# Vivado block design design_1, xczu48dr-ffvg1517-2-e, Vivado 2024.1
# (continued, part 3 of 7)
current_bd_instance /hp_sec8/One_port8/CAMC_with3
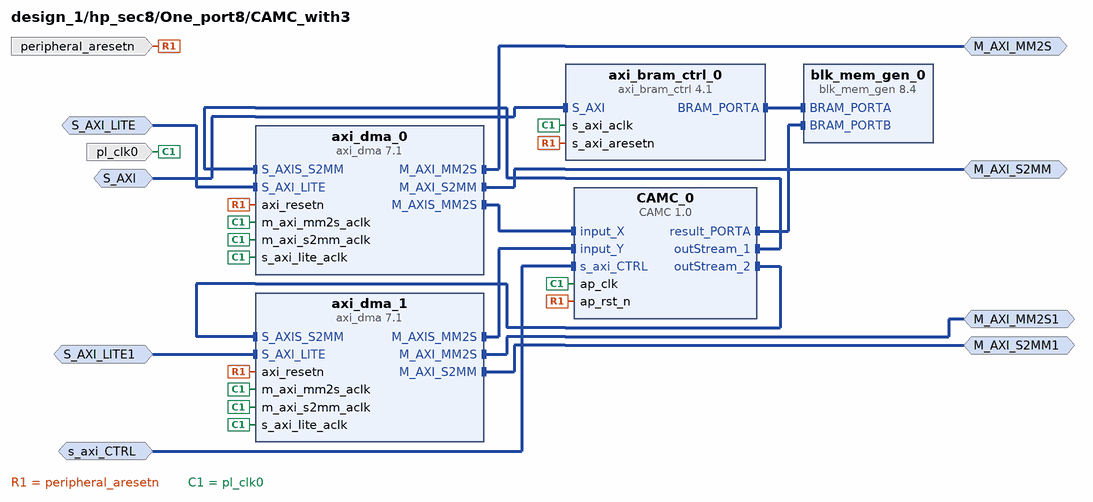
[diagram p48: block diagram inside /hp_sec8/One_port8/CAMC_with3]
create_bd_intf_pin -mode Master -vlnv xilinx.com:interface:aximm_rtl:1.0 M_AXI_MM2S
create_bd_intf_pin -mode Master -vlnv xilinx.com:interface:aximm_rtl:1.0 M_AXI_S2MM
create_bd_intf_pin -mode Slave -vlnv xilinx.com:interface:aximm_rtl:1.0 S_AXI
create_bd_intf_pin -mode Slave -vlnv xilinx.com:interface:aximm_rtl:1.0 S_AXI_LITE
create_bd_intf_pin -mode Master -vlnv xilinx.com:interface:aximm_rtl:1.0 M_AXI_MM2S1
create_bd_intf_pin -mode Master -vlnv xilinx.com:interface:aximm_rtl:1.0 M_AXI_S2MM1
create_bd_intf_pin -mode Slave -vlnv xilinx.com:interface:aximm_rtl:1.0 S_AXI_LITE1
create_bd_intf_pin -mode Slave -vlnv xilinx.com:interface:aximm_rtl:1.0 s_axi_CTRL
create_bd_pin -dir I -type clk pl_clk0
create_bd_pin -dir I -type rst peripheral_aresetn

create_bd_cell -type ip -vlnv xilinx.com:hls:CAMC:1.0 CAMC_0
create_bd_cell -type ip -vlnv xilinx.com:ip:axi_bram_ctrl:4.1 axi_bram_ctrl_0
set_property -dict {CONFIG.SINGLE_PORT_BRAM 1} [get_bd_cells axi_bram_ctrl_0]
create_bd_cell -type ip -vlnv xilinx.com:ip:axi_dma:7.1 axi_dma_0
set_property -dict {CONFIG.c_include_mm2s_dre 1 CONFIG.c_include_s2mm_dre 1 CONFIG.c_include_sg 0} [get_bd_cells axi_dma_0]
create_bd_cell -type ip -vlnv xilinx.com:ip:axi_dma:7.1 axi_dma_1
set_property -dict {CONFIG.c_include_mm2s_dre 1 CONFIG.c_include_s2mm_dre 1 CONFIG.c_include_sg 0} [get_bd_cells axi_dma_1]
create_bd_cell -type ip -vlnv xilinx.com:ip:blk_mem_gen:8.4 blk_mem_gen_0
set_property -dict {CONFIG.Memory_Type True_Dual_Port_RAM} [get_bd_cells blk_mem_gen_0]

# ---- connections ----

current_bd_instance /hp_sec
connect_bd_intf_net [get_bd_intf_pins smartconnect_0/S00_AXI] [get_bd_intf_pins S00_AXI]
connect_bd_intf_net [get_bd_intf_pins M00_AXI] [get_bd_intf_pins One_port8/M00_AXI]
connect_bd_intf_net [get_bd_intf_pins One_port8/S_AXI1] [get_bd_intf_pins smartconnect_0/M01_AXI]
connect_bd_intf_net [get_bd_intf_pins One_port8/S_AXI2] [get_bd_intf_pins smartconnect_0/M02_AXI]
connect_bd_intf_net [get_bd_intf_pins One_port8/S_AXI3] [get_bd_intf_pins smartconnect_0/M03_AXI]
connect_bd_intf_net [get_bd_intf_pins One_port8/S_AXI] [get_bd_intf_pins smartconnect_0/M00_AXI]
connect_bd_intf_net [get_bd_intf_pins One_port8/S_AXI_LITE1] [get_bd_intf_pins smartconnect_0/M05_AXI]
connect_bd_intf_net [get_bd_intf_pins One_port8/S_AXI_LITE2] [get_bd_intf_pins smartconnect_0/M06_AXI]
connect_bd_intf_net [get_bd_intf_pins One_port8/S_AXI_LITE] [get_bd_intf_pins smartconnect_0/M04_AXI]
connect_bd_intf_net [get_bd_intf_pins smartconnect_0/M07_AXI] [get_bd_intf_pins One_port8/S_AXI_LITE3]
connect_bd_intf_net [get_bd_intf_pins smartconnect_0/M08_AXI] [get_bd_intf_pins One_port8/S_AXI_LITE4]
connect_bd_intf_net [get_bd_intf_pins smartconnect_0/M09_AXI] [get_bd_intf_pins One_port8/S_AXI_LITE5]
connect_bd_intf_net [get_bd_intf_pins smartconnect_0/M10_AXI] [get_bd_intf_pins One_port8/S_AXI_LITE6]
connect_bd_intf_net [get_bd_intf_pins smartconnect_0/M11_AXI] [get_bd_intf_pins One_port8/S_AXI_LITE7]
connect_bd_intf_net [get_bd_intf_pins smartconnect_0/M12_AXI] [get_bd_intf_pins One_port8/s_axi_CTRL]
connect_bd_intf_net [get_bd_intf_pins smartconnect_0/M13_AXI] [get_bd_intf_pins One_port8/s_axi_CTRL1]
connect_bd_intf_net [get_bd_intf_pins smartconnect_0/M14_AXI] [get_bd_intf_pins One_port8/s_axi_CTRL2]
connect_bd_intf_net [get_bd_intf_pins smartconnect_0/M15_AXI] [get_bd_intf_pins One_port8/s_axi_CTRL3]
connect_bd_net [get_bd_pins s_axi_aclk] [get_bd_pins One_port8/s_axi_aclk] [get_bd_pins smartconnect_0/aclk]
connect_bd_net [get_bd_pins s_axi_aresetn] [get_bd_pins One_port8/s_axi_aresetn]

current_bd_instance /hp_sec/One_port8
connect_bd_intf_net [get_bd_intf_pins axi_interconnect_0/M00_AXI] [get_bd_intf_pins M00_AXI]
connect_bd_intf_net [get_bd_intf_pins CAMC_with/S_AXI] [get_bd_intf_pins S_AXI]
connect_bd_intf_net [get_bd_intf_pins CAMC_with1/S_AXI] [get_bd_intf_pins S_AXI1]
connect_bd_intf_net [get_bd_intf_pins CAMC_with2/S_AXI] [get_bd_intf_pins S_AXI2]
connect_bd_intf_net [get_bd_intf_pins CAMC_with3/S_AXI] [get_bd_intf_pins S_AXI3]
connect_bd_intf_net [get_bd_intf_pins CAMC_with/S_AXI_LITE] [get_bd_intf_pins S_AXI_LITE]
connect_bd_intf_net [get_bd_intf_pins CAMC_with/S_AXI_LITE1] [get_bd_intf_pins S_AXI_LITE1]
connect_bd_intf_net [get_bd_intf_pins CAMC_with1/S_AXI_LITE] [get_bd_intf_pins S_AXI_LITE2]
connect_bd_intf_net [get_bd_intf_pins CAMC_with1/S_AXI_LITE1] [get_bd_intf_pins S_AXI_LITE3]
connect_bd_intf_net [get_bd_intf_pins CAMC_with2/S_AXI_LITE] [get_bd_intf_pins S_AXI_LITE4]
connect_bd_intf_net [get_bd_intf_pins CAMC_with2/S_AXI_LITE1] [get_bd_intf_pins S_AXI_LITE5]
connect_bd_intf_net [get_bd_intf_pins CAMC_with3/S_AXI_LITE] [get_bd_intf_pins S_AXI_LITE6]
connect_bd_intf_net [get_bd_intf_pins CAMC_with3/S_AXI_LITE1] [get_bd_intf_pins S_AXI_LITE7]
connect_bd_intf_net [get_bd_intf_pins CAMC_with/s_axi_CTRL] [get_bd_intf_pins s_axi_CTRL]
connect_bd_intf_net [get_bd_intf_pins CAMC_with1/s_axi_CTRL] [get_bd_intf_pins s_axi_CTRL1]
connect_bd_intf_net [get_bd_intf_pins CAMC_with2/s_axi_CTRL] [get_bd_intf_pins s_axi_CTRL2]
connect_bd_intf_net [get_bd_intf_pins CAMC_with3/s_axi_CTRL] [get_bd_intf_pins s_axi_CTRL3]
connect_bd_intf_net [get_bd_intf_pins axi_interconnect_0/S00_AXI] [get_bd_intf_pins CAMC_with/M_AXI_MM2S]
connect_bd_intf_net [get_bd_intf_pins axi_interconnect_0/S01_AXI] [get_bd_intf_pins CAMC_with/M_AXI_S2MM]
connect_bd_intf_net [get_bd_intf_pins axi_interconnect_0/S02_AXI] [get_bd_intf_pins CAMC_with1/M_AXI_MM2S]
connect_bd_intf_net [get_bd_intf_pins axi_interconnect_0/S03_AXI] [get_bd_intf_pins CAMC_with1/M_AXI_S2MM]
connect_bd_intf_net [get_bd_intf_pins axi_interconnect_0/S04_AXI] [get_bd_intf_pins CAMC_with2/M_AXI_MM2S]
connect_bd_intf_net [get_bd_intf_pins axi_interconnect_0/S05_AXI] [get_bd_intf_pins CAMC_with2/M_AXI_S2MM]
connect_bd_intf_net [get_bd_intf_pins axi_interconnect_0/S06_AXI] [get_bd_intf_pins CAMC_with3/M_AXI_MM2S]
connect_bd_intf_net [get_bd_intf_pins axi_interconnect_0/S07_AXI] [get_bd_intf_pins CAMC_with3/M_AXI_S2MM]
connect_bd_intf_net [get_bd_intf_pins axi_interconnect_0/S08_AXI] [get_bd_intf_pins CAMC_with/M_AXI_MM2S1]
connect_bd_intf_net [get_bd_intf_pins axi_interconnect_0/S09_AXI] [get_bd_intf_pins CAMC_with/M_AXI_S2MM1]
connect_bd_intf_net [get_bd_intf_pins axi_interconnect_0/S10_AXI] [get_bd_intf_pins CAMC_with1/M_AXI_MM2S1]
connect_bd_intf_net [get_bd_intf_pins axi_interconnect_0/S11_AXI] [get_bd_intf_pins CAMC_with1/M_AXI_S2MM1]
connect_bd_intf_net [get_bd_intf_pins axi_interconnect_0/S12_AXI] [get_bd_intf_pins CAMC_with2/M_AXI_MM2S1]
connect_bd_intf_net [get_bd_intf_pins axi_interconnect_0/S13_AXI] [get_bd_intf_pins CAMC_with2/M_AXI_S2MM1]
connect_bd_intf_net [get_bd_intf_pins axi_interconnect_0/S14_AXI] [get_bd_intf_pins CAMC_with3/M_AXI_MM2S1]
connect_bd_intf_net [get_bd_intf_pins axi_interconnect_0/S15_AXI] [get_bd_intf_pins CAMC_with3/M_AXI_S2MM1]
connect_bd_net [get_bd_pins s_axi_aclk] \
  [get_bd_pins CAMC_with/s_axi_aclk] [get_bd_pins CAMC_with1/pl_clk0] [get_bd_pins CAMC_with2/pl_clk0] \
  [get_bd_pins CAMC_with3/pl_clk0] [get_bd_pins axi_interconnect_0/S00_ACLK] [get_bd_pins axi_interconnect_0/S01_ACLK] \
  [get_bd_pins axi_interconnect_0/S08_ACLK] [get_bd_pins axi_interconnect_0/M00_ACLK] [get_bd_pins axi_interconnect_0/ACLK] \
  [get_bd_pins axi_interconnect_0/S09_ACLK] [get_bd_pins axi_interconnect_0/S02_ACLK] \
  [get_bd_pins axi_interconnect_0/S03_ACLK] [get_bd_pins axi_interconnect_0/S10_ACLK] \
  [get_bd_pins axi_interconnect_0/S11_ACLK] [get_bd_pins axi_interconnect_0/S04_ACLK] \
  [get_bd_pins axi_interconnect_0/S05_ACLK] [get_bd_pins axi_interconnect_0/S12_ACLK] \
  [get_bd_pins axi_interconnect_0/S13_ACLK] [get_bd_pins axi_interconnect_0/S06_ACLK] \
  [get_bd_pins axi_interconnect_0/S07_ACLK] [get_bd_pins axi_interconnect_0/S14_ACLK] \
  [get_bd_pins axi_interconnect_0/S15_ACLK]
connect_bd_net [get_bd_pins s_axi_aresetn] \
  [get_bd_pins CAMC_with/s_axi_aresetn] [get_bd_pins CAMC_with1/peripheral_aresetn] \
  [get_bd_pins CAMC_with2/peripheral_aresetn] [get_bd_pins CAMC_with3/peripheral_aresetn] \
  [get_bd_pins axi_interconnect_0/S00_ARESETN] [get_bd_pins axi_interconnect_0/S01_ARESETN] \
  [get_bd_pins axi_interconnect_0/S08_ARESETN] [get_bd_pins axi_interconnect_0/M00_ARESETN] \
  [get_bd_pins axi_interconnect_0/ARESETN] [get_bd_pins axi_interconnect_0/S09_ARESETN] \
  [get_bd_pins axi_interconnect_0/S02_ARESETN] [get_bd_pins axi_interconnect_0/S03_ARESETN] \
  [get_bd_pins axi_interconnect_0/S10_ARESETN] [get_bd_pins axi_interconnect_0/S11_ARESETN] \
  [get_bd_pins axi_interconnect_0/S04_ARESETN] [get_bd_pins axi_interconnect_0/S05_ARESETN] \
  [get_bd_pins axi_interconnect_0/S12_ARESETN] [get_bd_pins axi_interconnect_0/S13_ARESETN] \
  [get_bd_pins axi_interconnect_0/S06_ARESETN] [get_bd_pins axi_interconnect_0/S07_ARESETN] \
  [get_bd_pins axi_interconnect_0/S14_ARESETN] [get_bd_pins axi_interconnect_0/S15_ARESETN]

current_bd_instance /hp_sec/One_port8/CAMC_with
connect_bd_intf_net [get_bd_intf_pins axi_dma_0/S_AXIS_S2MM] [get_bd_intf_pins CAMC_0/outStream_1]
connect_bd_intf_net [get_bd_intf_pins axi_dma_1/S_AXIS_S2MM] [get_bd_intf_pins CAMC_0/outStream_2]
connect_bd_intf_net [get_bd_intf_pins blk_mem_gen_0/BRAM_PORTB] [get_bd_intf_pins CAMC_0/result_PORTA]
connect_bd_intf_net [get_bd_intf_pins axi_dma_0/M_AXI_MM2S] [get_bd_intf_pins M_AXI_MM2S]
connect_bd_intf_net [get_bd_intf_pins axi_dma_0/M_AXI_S2MM] [get_bd_intf_pins M_AXI_S2MM]
connect_bd_intf_net [get_bd_intf_pins axi_bram_ctrl_0/S_AXI] [get_bd_intf_pins S_AXI]
connect_bd_intf_net [get_bd_intf_pins axi_dma_0/S_AXI_LITE] [get_bd_intf_pins S_AXI_LITE]
connect_bd_intf_net [get_bd_intf_pins axi_dma_1/M_AXI_MM2S] [get_bd_intf_pins M_AXI_MM2S1]
connect_bd_intf_net [get_bd_intf_pins axi_dma_1/M_AXI_S2MM] [get_bd_intf_pins M_AXI_S2MM1]
connect_bd_intf_net [get_bd_intf_pins axi_dma_1/S_AXI_LITE] [get_bd_intf_pins S_AXI_LITE1]
connect_bd_intf_net [get_bd_intf_pins CAMC_0/s_axi_CTRL] [get_bd_intf_pins s_axi_CTRL]
connect_bd_intf_net [get_bd_intf_pins axi_bram_ctrl_0/BRAM_PORTA] [get_bd_intf_pins blk_mem_gen_0/BRAM_PORTA]
connect_bd_intf_net [get_bd_intf_pins CAMC_0/input_X] [get_bd_intf_pins axi_dma_0/M_AXIS_MM2S]
connect_bd_intf_net [get_bd_intf_pins CAMC_0/input_Y] [get_bd_intf_pins axi_dma_1/M_AXIS_MM2S]
connect_bd_net [get_bd_pins s_axi_aclk] \
  [get_bd_pins axi_bram_ctrl_0/s_axi_aclk] [get_bd_pins axi_dma_0/m_axi_mm2s_aclk] [get_bd_pins CAMC_0/ap_clk] \
  [get_bd_pins axi_dma_0/m_axi_s2mm_aclk] [get_bd_pins axi_dma_0/s_axi_lite_aclk] [get_bd_pins axi_dma_1/m_axi_mm2s_aclk] \
  [get_bd_pins axi_dma_1/m_axi_s2mm_aclk] [get_bd_pins axi_dma_1/s_axi_lite_aclk]
connect_bd_net [get_bd_pins s_axi_aresetn] \
  [get_bd_pins axi_bram_ctrl_0/s_axi_aresetn] [get_bd_pins CAMC_0/ap_rst_n] [get_bd_pins axi_dma_0/axi_resetn] \
  [get_bd_pins axi_dma_1/axi_resetn]

current_bd_instance /hp_sec/One_port8/CAMC_with1
connect_bd_intf_net [get_bd_intf_pins axi_dma_0/S_AXIS_S2MM] [get_bd_intf_pins CAMC_0/outStream_1]
connect_bd_intf_net [get_bd_intf_pins axi_dma_1/S_AXIS_S2MM] [get_bd_intf_pins CAMC_0/outStream_2]
connect_bd_intf_net [get_bd_intf_pins blk_mem_gen_0/BRAM_PORTB] [get_bd_intf_pins CAMC_0/result_PORTA]
connect_bd_intf_net [get_bd_intf_pins axi_dma_0/M_AXI_MM2S] [get_bd_intf_pins M_AXI_MM2S]
connect_bd_intf_net [get_bd_intf_pins axi_dma_0/M_AXI_S2MM] [get_bd_intf_pins M_AXI_S2MM]
connect_bd_intf_net [get_bd_intf_pins axi_bram_ctrl_0/S_AXI] [get_bd_intf_pins S_AXI]
connect_bd_intf_net [get_bd_intf_pins axi_dma_0/S_AXI_LITE] [get_bd_intf_pins S_AXI_LITE]
connect_bd_intf_net [get_bd_intf_pins axi_dma_1/M_AXI_MM2S] [get_bd_intf_pins M_AXI_MM2S1]
connect_bd_intf_net [get_bd_intf_pins axi_dma_1/M_AXI_S2MM] [get_bd_intf_pins M_AXI_S2MM1]
connect_bd_intf_net [get_bd_intf_pins axi_dma_1/S_AXI_LITE] [get_bd_intf_pins S_AXI_LITE1]
connect_bd_intf_net [get_bd_intf_pins CAMC_0/s_axi_CTRL] [get_bd_intf_pins s_axi_CTRL]
connect_bd_intf_net [get_bd_intf_pins axi_bram_ctrl_0/BRAM_PORTA] [get_bd_intf_pins blk_mem_gen_0/BRAM_PORTA]
connect_bd_intf_net [get_bd_intf_pins CAMC_0/input_X] [get_bd_intf_pins axi_dma_0/M_AXIS_MM2S]
connect_bd_intf_net [get_bd_intf_pins CAMC_0/input_Y] [get_bd_intf_pins axi_dma_1/M_AXIS_MM2S]
connect_bd_net [get_bd_pins peripheral_aresetn] \
  [get_bd_pins axi_bram_ctrl_0/s_axi_aresetn] [get_bd_pins CAMC_0/ap_rst_n] [get_bd_pins axi_dma_0/axi_resetn] \
  [get_bd_pins axi_dma_1/axi_resetn]
connect_bd_net -net pl_clk0_1 [get_bd_pins pl_clk0] \
  [get_bd_pins axi_bram_ctrl_0/s_axi_aclk] [get_bd_pins axi_dma_0/m_axi_mm2s_aclk] [get_bd_pins CAMC_0/ap_clk] \
  [get_bd_pins axi_dma_0/m_axi_s2mm_aclk] [get_bd_pins axi_dma_0/s_axi_lite_aclk] [get_bd_pins axi_dma_1/m_axi_mm2s_aclk] \
  [get_bd_pins axi_dma_1/m_axi_s2mm_aclk] [get_bd_pins axi_dma_1/s_axi_lite_aclk]

current_bd_instance /hp_sec/One_port8/CAMC_with2
connect_bd_intf_net [get_bd_intf_pins axi_dma_0/S_AXIS_S2MM] [get_bd_intf_pins CAMC_0/outStream_1]
connect_bd_intf_net [get_bd_intf_pins axi_dma_1/S_AXIS_S2MM] [get_bd_intf_pins CAMC_0/outStream_2]
connect_bd_intf_net [get_bd_intf_pins blk_mem_gen_0/BRAM_PORTB] [get_bd_intf_pins CAMC_0/result_PORTA]
connect_bd_intf_net [get_bd_intf_pins axi_dma_0/M_AXI_MM2S] [get_bd_intf_pins M_AXI_MM2S]
connect_bd_intf_net [get_bd_intf_pins axi_dma_0/M_AXI_S2MM] [get_bd_intf_pins M_AXI_S2MM]
connect_bd_intf_net [get_bd_intf_pins axi_bram_ctrl_0/S_AXI] [get_bd_intf_pins S_AXI]
connect_bd_intf_net [get_bd_intf_pins axi_dma_0/S_AXI_LITE] [get_bd_intf_pins S_AXI_LITE]
connect_bd_intf_net [get_bd_intf_pins axi_dma_1/M_AXI_MM2S] [get_bd_intf_pins M_AXI_MM2S1]
connect_bd_intf_net [get_bd_intf_pins axi_dma_1/M_AXI_S2MM] [get_bd_intf_pins M_AXI_S2MM1]
connect_bd_intf_net [get_bd_intf_pins axi_dma_1/S_AXI_LITE] [get_bd_intf_pins S_AXI_LITE1]
connect_bd_intf_net [get_bd_intf_pins CAMC_0/s_axi_CTRL] [get_bd_intf_pins s_axi_CTRL]
connect_bd_intf_net [get_bd_intf_pins axi_bram_ctrl_0/BRAM_PORTA] [get_bd_intf_pins blk_mem_gen_0/BRAM_PORTA]
connect_bd_intf_net [get_bd_intf_pins CAMC_0/input_X] [get_bd_intf_pins axi_dma_0/M_AXIS_MM2S]
connect_bd_intf_net [get_bd_intf_pins CAMC_0/input_Y] [get_bd_intf_pins axi_dma_1/M_AXIS_MM2S]
connect_bd_net [get_bd_pins peripheral_aresetn] \
  [get_bd_pins axi_bram_ctrl_0/s_axi_aresetn] [get_bd_pins CAMC_0/ap_rst_n] [get_bd_pins axi_dma_0/axi_resetn] \
  [get_bd_pins axi_dma_1/axi_resetn]
connect_bd_net -net pl_clk0_1 [get_bd_pins pl_clk0] \
  [get_bd_pins axi_bram_ctrl_0/s_axi_aclk] [get_bd_pins axi_dma_0/m_axi_mm2s_aclk] [get_bd_pins CAMC_0/ap_clk] \
  [get_bd_pins axi_dma_0/m_axi_s2mm_aclk] [get_bd_pins axi_dma_0/s_axi_lite_aclk] [get_bd_pins axi_dma_1/m_axi_mm2s_aclk] \
  [get_bd_pins axi_dma_1/m_axi_s2mm_aclk] [get_bd_pins axi_dma_1/s_axi_lite_aclk]

current_bd_instance /hp_sec/One_port8/CAMC_with3
connect_bd_intf_net [get_bd_intf_pins axi_dma_0/S_AXIS_S2MM] [get_bd_intf_pins CAMC_0/outStream_1]
connect_bd_intf_net [get_bd_intf_pins axi_dma_1/S_AXIS_S2MM] [get_bd_intf_pins CAMC_0/outStream_2]
connect_bd_intf_net [get_bd_intf_pins blk_mem_gen_0/BRAM_PORTB] [get_bd_intf_pins CAMC_0/result_PORTA]
connect_bd_intf_net [get_bd_intf_pins axi_dma_0/M_AXI_MM2S] [get_bd_intf_pins M_AXI_MM2S]
connect_bd_intf_net [get_bd_intf_pins axi_dma_0/M_AXI_S2MM] [get_bd_intf_pins M_AXI_S2MM]
connect_bd_intf_net [get_bd_intf_pins axi_bram_ctrl_0/S_AXI] [get_bd_intf_pins S_AXI]
connect_bd_intf_net [get_bd_intf_pins axi_dma_0/S_AXI_LITE] [get_bd_intf_pins S_AXI_LITE]
connect_bd_intf_net [get_bd_intf_pins axi_dma_1/M_AXI_MM2S] [get_bd_intf_pins M_AXI_MM2S1]
connect_bd_intf_net [get_bd_intf_pins axi_dma_1/M_AXI_S2MM] [get_bd_intf_pins M_AXI_S2MM1]
connect_bd_intf_net [get_bd_intf_pins axi_dma_1/S_AXI_LITE] [get_bd_intf_pins S_AXI_LITE1]
connect_bd_intf_net [get_bd_intf_pins CAMC_0/s_axi_CTRL] [get_bd_intf_pins s_axi_CTRL]
connect_bd_intf_net [get_bd_intf_pins axi_bram_ctrl_0/BRAM_PORTA] [get_bd_intf_pins blk_mem_gen_0/BRAM_PORTA]
connect_bd_intf_net [get_bd_intf_pins CAMC_0/input_X] [get_bd_intf_pins axi_dma_0/M_AXIS_MM2S]
connect_bd_intf_net [get_bd_intf_pins CAMC_0/input_Y] [get_bd_intf_pins axi_dma_1/M_AXIS_MM2S]
connect_bd_net [get_bd_pins peripheral_aresetn] \
  [get_bd_pins axi_bram_ctrl_0/s_axi_aresetn] [get_bd_pins CAMC_0/ap_rst_n] [get_bd_pins axi_dma_0/axi_resetn] \
  [get_bd_pins axi_dma_1/axi_resetn]
connect_bd_net -net pl_clk0_1 [get_bd_pins pl_clk0] \
  [get_bd_pins axi_bram_ctrl_0/s_axi_aclk] [get_bd_pins axi_dma_0/m_axi_mm2s_aclk] [get_bd_pins CAMC_0/ap_clk] \
  [get_bd_pins axi_dma_0/m_axi_s2mm_aclk] [get_bd_pins axi_dma_0/s_axi_lite_aclk] [get_bd_pins axi_dma_1/m_axi_mm2s_aclk] \
  [get_bd_pins axi_dma_1/m_axi_s2mm_aclk] [get_bd_pins axi_dma_1/s_axi_lite_aclk]

current_bd_instance /hp_sec1
connect_bd_intf_net [get_bd_intf_pins smartconnect_0/S00_AXI] [get_bd_intf_pins S00_AXI]
connect_bd_intf_net [get_bd_intf_pins M00_AXI] [get_bd_intf_pins One_port8/M00_AXI]
connect_bd_intf_net [get_bd_intf_pins One_port8/S_AXI1] [get_bd_intf_pins smartconnect_0/M01_AXI]
connect_bd_intf_net [get_bd_intf_pins One_port8/S_AXI2] [get_bd_intf_pins smartconnect_0/M02_AXI]
connect_bd_intf_net [get_bd_intf_pins One_port8/S_AXI3] [get_bd_intf_pins smartconnect_0/M03_AXI]
connect_bd_intf_net [get_bd_intf_pins One_port8/S_AXI] [get_bd_intf_pins smartconnect_0/M00_AXI]
connect_bd_intf_net [get_bd_intf_pins One_port8/S_AXI_LITE1] [get_bd_intf_pins smartconnect_0/M05_AXI]
connect_bd_intf_net [get_bd_intf_pins One_port8/S_AXI_LITE2] [get_bd_intf_pins smartconnect_0/M06_AXI]
connect_bd_intf_net [get_bd_intf_pins One_port8/S_AXI_LITE] [get_bd_intf_pins smartconnect_0/M04_AXI]
connect_bd_intf_net [get_bd_intf_pins smartconnect_0/M07_AXI] [get_bd_intf_pins One_port8/S_AXI_LITE3]
connect_bd_intf_net [get_bd_intf_pins smartconnect_0/M08_AXI] [get_bd_intf_pins One_port8/S_AXI_LITE4]
connect_bd_intf_net [get_bd_intf_pins smartconnect_0/M09_AXI] [get_bd_intf_pins One_port8/S_AXI_LITE5]
connect_bd_intf_net [get_bd_intf_pins smartconnect_0/M10_AXI] [get_bd_intf_pins One_port8/S_AXI_LITE6]
connect_bd_intf_net [get_bd_intf_pins smartconnect_0/M11_AXI] [get_bd_intf_pins One_port8/S_AXI_LITE7]
connect_bd_intf_net [get_bd_intf_pins smartconnect_0/M12_AXI] [get_bd_intf_pins One_port8/s_axi_CTRL]
connect_bd_intf_net [get_bd_intf_pins smartconnect_0/M13_AXI] [get_bd_intf_pins One_port8/s_axi_CTRL1]
connect_bd_intf_net [get_bd_intf_pins smartconnect_0/M14_AXI] [get_bd_intf_pins One_port8/s_axi_CTRL2]
connect_bd_intf_net [get_bd_intf_pins smartconnect_0/M15_AXI] [get_bd_intf_pins One_port8/s_axi_CTRL3]
connect_bd_net [get_bd_pins s_axi_aclk] [get_bd_pins One_port8/s_axi_aclk] [get_bd_pins smartconnect_0/aclk]
connect_bd_net [get_bd_pins s_axi_aresetn] [get_bd_pins One_port8/s_axi_aresetn]

current_bd_instance /hp_sec1/One_port8
connect_bd_intf_net [get_bd_intf_pins axi_interconnect_0/M00_AXI] [get_bd_intf_pins M00_AXI]
connect_bd_intf_net [get_bd_intf_pins CAMC_with/S_AXI] [get_bd_intf_pins S_AXI]
connect_bd_intf_net [get_bd_intf_pins CAMC_with1/S_AXI] [get_bd_intf_pins S_AXI1]
connect_bd_intf_net [get_bd_intf_pins CAMC_with2/S_AXI] [get_bd_intf_pins S_AXI2]
connect_bd_intf_net [get_bd_intf_pins CAMC_with3/S_AXI] [get_bd_intf_pins S_AXI3]
connect_bd_intf_net [get_bd_intf_pins CAMC_with/S_AXI_LITE] [get_bd_intf_pins S_AXI_LITE]
connect_bd_intf_net [get_bd_intf_pins CAMC_with/S_AXI_LITE1] [get_bd_intf_pins S_AXI_LITE1]
connect_bd_intf_net [get_bd_intf_pins CAMC_with1/S_AXI_LITE] [get_bd_intf_pins S_AXI_LITE2]
connect_bd_intf_net [get_bd_intf_pins CAMC_with1/S_AXI_LITE1] [get_bd_intf_pins S_AXI_LITE3]
connect_bd_intf_net [get_bd_intf_pins CAMC_with2/S_AXI_LITE] [get_bd_intf_pins S_AXI_LITE4]
connect_bd_intf_net [get_bd_intf_pins CAMC_with2/S_AXI_LITE1] [get_bd_intf_pins S_AXI_LITE5]
connect_bd_intf_net [get_bd_intf_pins CAMC_with3/S_AXI_LITE] [get_bd_intf_pins S_AXI_LITE6]
connect_bd_intf_net [get_bd_intf_pins CAMC_with3/S_AXI_LITE1] [get_bd_intf_pins S_AXI_LITE7]
connect_bd_intf_net [get_bd_intf_pins CAMC_with/s_axi_CTRL] [get_bd_intf_pins s_axi_CTRL]
connect_bd_intf_net [get_bd_intf_pins CAMC_with1/s_axi_CTRL] [get_bd_intf_pins s_axi_CTRL1]
connect_bd_intf_net [get_bd_intf_pins CAMC_with2/s_axi_CTRL] [get_bd_intf_pins s_axi_CTRL2]
connect_bd_intf_net [get_bd_intf_pins CAMC_with3/s_axi_CTRL] [get_bd_intf_pins s_axi_CTRL3]
connect_bd_intf_net [get_bd_intf_pins axi_interconnect_0/S00_AXI] [get_bd_intf_pins CAMC_with/M_AXI_MM2S]
connect_bd_intf_net [get_bd_intf_pins axi_interconnect_0/S01_AXI] [get_bd_intf_pins CAMC_with/M_AXI_S2MM]
connect_bd_intf_net [get_bd_intf_pins axi_interconnect_0/S02_AXI] [get_bd_intf_pins CAMC_with1/M_AXI_MM2S]
connect_bd_intf_net [get_bd_intf_pins axi_interconnect_0/S03_AXI] [get_bd_intf_pins CAMC_with1/M_AXI_S2MM]
connect_bd_intf_net [get_bd_intf_pins axi_interconnect_0/S04_AXI] [get_bd_intf_pins CAMC_with2/M_AXI_MM2S]
connect_bd_intf_net [get_bd_intf_pins axi_interconnect_0/S05_AXI] [get_bd_intf_pins CAMC_with2/M_AXI_S2MM]
connect_bd_intf_net [get_bd_intf_pins axi_interconnect_0/S06_AXI] [get_bd_intf_pins CAMC_with3/M_AXI_MM2S]
connect_bd_intf_net [get_bd_intf_pins axi_interconnect_0/S07_AXI] [get_bd_intf_pins CAMC_with3/M_AXI_S2MM]
connect_bd_intf_net [get_bd_intf_pins axi_interconnect_0/S08_AXI] [get_bd_intf_pins CAMC_with/M_AXI_MM2S1]
connect_bd_intf_net [get_bd_intf_pins axi_interconnect_0/S09_AXI] [get_bd_intf_pins CAMC_with/M_AXI_S2MM1]
connect_bd_intf_net [get_bd_intf_pins axi_interconnect_0/S10_AXI] [get_bd_intf_pins CAMC_with1/M_AXI_MM2S1]
connect_bd_intf_net [get_bd_intf_pins axi_interconnect_0/S11_AXI] [get_bd_intf_pins CAMC_with1/M_AXI_S2MM1]
connect_bd_intf_net [get_bd_intf_pins axi_interconnect_0/S12_AXI] [get_bd_intf_pins CAMC_with2/M_AXI_MM2S1]
connect_bd_intf_net [get_bd_intf_pins axi_interconnect_0/S13_AXI] [get_bd_intf_pins CAMC_with2/M_AXI_S2MM1]
connect_bd_intf_net [get_bd_intf_pins axi_interconnect_0/S14_AXI] [get_bd_intf_pins CAMC_with3/M_AXI_MM2S1]
connect_bd_intf_net [get_bd_intf_pins axi_interconnect_0/S15_AXI] [get_bd_intf_pins CAMC_with3/M_AXI_S2MM1]
connect_bd_net [get_bd_pins s_axi_aclk] \
  [get_bd_pins CAMC_with/s_axi_aclk] [get_bd_pins CAMC_with1/pl_clk0] [get_bd_pins CAMC_with2/pl_clk0] \
  [get_bd_pins CAMC_with3/pl_clk0] [get_bd_pins axi_interconnect_0/S00_ACLK] [get_bd_pins axi_interconnect_0/S01_ACLK] \
  [get_bd_pins axi_interconnect_0/S08_ACLK] [get_bd_pins axi_interconnect_0/M00_ACLK] [get_bd_pins axi_interconnect_0/ACLK] \
  [get_bd_pins axi_interconnect_0/S09_ACLK] [get_bd_pins axi_interconnect_0/S02_ACLK] \
  [get_bd_pins axi_interconnect_0/S03_ACLK] [get_bd_pins axi_interconnect_0/S10_ACLK] \
  [get_bd_pins axi_interconnect_0/S11_ACLK] [get_bd_pins axi_interconnect_0/S04_ACLK] \
  [get_bd_pins axi_interconnect_0/S05_ACLK] [get_bd_pins axi_interconnect_0/S12_ACLK] \
  [get_bd_pins axi_interconnect_0/S13_ACLK] [get_bd_pins axi_interconnect_0/S06_ACLK] \
  [get_bd_pins axi_interconnect_0/S07_ACLK] [get_bd_pins axi_interconnect_0/S14_ACLK] \
  [get_bd_pins axi_interconnect_0/S15_ACLK]
connect_bd_net [get_bd_pins s_axi_aresetn] \
  [get_bd_pins CAMC_with/s_axi_aresetn] [get_bd_pins CAMC_with1/peripheral_aresetn] \
  [get_bd_pins CAMC_with2/peripheral_aresetn] [get_bd_pins CAMC_with3/peripheral_aresetn] \
  [get_bd_pins axi_interconnect_0/S00_ARESETN] [get_bd_pins axi_interconnect_0/S01_ARESETN] \
  [get_bd_pins axi_interconnect_0/S08_ARESETN] [get_bd_pins axi_interconnect_0/M00_ARESETN] \
  [get_bd_pins axi_interconnect_0/ARESETN] [get_bd_pins axi_interconnect_0/S09_ARESETN] \
  [get_bd_pins axi_interconnect_0/S02_ARESETN] [get_bd_pins axi_interconnect_0/S03_ARESETN] \
  [get_bd_pins axi_interconnect_0/S10_ARESETN] [get_bd_pins axi_interconnect_0/S11_ARESETN] \
  [get_bd_pins axi_interconnect_0/S04_ARESETN] [get_bd_pins axi_interconnect_0/S05_ARESETN] \
  [get_bd_pins axi_interconnect_0/S12_ARESETN] [get_bd_pins axi_interconnect_0/S13_ARESETN] \
  [get_bd_pins axi_interconnect_0/S06_ARESETN] [get_bd_pins axi_interconnect_0/S07_ARESETN] \
  [get_bd_pins axi_interconnect_0/S14_ARESETN] [get_bd_pins axi_interconnect_0/S15_ARESETN]

current_bd_instance /hp_sec1/One_port8/CAMC_with
connect_bd_intf_net [get_bd_intf_pins axi_dma_0/S_AXIS_S2MM] [get_bd_intf_pins CAMC_0/outStream_1]
connect_bd_intf_net [get_bd_intf_pins axi_dma_1/S_AXIS_S2MM] [get_bd_intf_pins CAMC_0/outStream_2]
connect_bd_intf_net [get_bd_intf_pins blk_mem_gen_0/BRAM_PORTB] [get_bd_intf_pins CAMC_0/result_PORTA]
connect_bd_intf_net [get_bd_intf_pins axi_dma_0/M_AXI_MM2S] [get_bd_intf_pins M_AXI_MM2S]
connect_bd_intf_net [get_bd_intf_pins axi_dma_0/M_AXI_S2MM] [get_bd_intf_pins M_AXI_S2MM]
connect_bd_intf_net [get_bd_intf_pins axi_bram_ctrl_0/S_AXI] [get_bd_intf_pins S_AXI]
connect_bd_intf_net [get_bd_intf_pins axi_dma_0/S_AXI_LITE] [get_bd_intf_pins S_AXI_LITE]
connect_bd_intf_net [get_bd_intf_pins axi_dma_1/M_AXI_MM2S] [get_bd_intf_pins M_AXI_MM2S1]
connect_bd_intf_net [get_bd_intf_pins axi_dma_1/M_AXI_S2MM] [get_bd_intf_pins M_AXI_S2MM1]
connect_bd_intf_net [get_bd_intf_pins axi_dma_1/S_AXI_LITE] [get_bd_intf_pins S_AXI_LITE1]
connect_bd_intf_net [get_bd_intf_pins CAMC_0/s_axi_CTRL] [get_bd_intf_pins s_axi_CTRL]
connect_bd_intf_net [get_bd_intf_pins axi_bram_ctrl_0/BRAM_PORTA] [get_bd_intf_pins blk_mem_gen_0/BRAM_PORTA]
connect_bd_intf_net [get_bd_intf_pins CAMC_0/input_X] [get_bd_intf_pins axi_dma_0/M_AXIS_MM2S]
connect_bd_intf_net [get_bd_intf_pins CAMC_0/input_Y] [get_bd_intf_pins axi_dma_1/M_AXIS_MM2S]
connect_bd_net [get_bd_pins s_axi_aclk] \
  [get_bd_pins axi_bram_ctrl_0/s_axi_aclk] [get_bd_pins axi_dma_0/m_axi_mm2s_aclk] [get_bd_pins CAMC_0/ap_clk] \
  [get_bd_pins axi_dma_0/m_axi_s2mm_aclk] [get_bd_pins axi_dma_0/s_axi_lite_aclk] [get_bd_pins axi_dma_1/m_axi_mm2s_aclk] \
  [get_bd_pins axi_dma_1/m_axi_s2mm_aclk] [get_bd_pins axi_dma_1/s_axi_lite_aclk]
connect_bd_net [get_bd_pins s_axi_aresetn] \
  [get_bd_pins axi_bram_ctrl_0/s_axi_aresetn] [get_bd_pins CAMC_0/ap_rst_n] [get_bd_pins axi_dma_0/axi_resetn] \
  [get_bd_pins axi_dma_1/axi_resetn]

current_bd_instance /hp_sec1/One_port8/CAMC_with1
connect_bd_intf_net [get_bd_intf_pins axi_dma_0/S_AXIS_S2MM] [get_bd_intf_pins CAMC_0/outStream_1]
connect_bd_intf_net [get_bd_intf_pins axi_dma_1/S_AXIS_S2MM] [get_bd_intf_pins CAMC_0/outStream_2]
connect_bd_intf_net [get_bd_intf_pins blk_mem_gen_0/BRAM_PORTB] [get_bd_intf_pins CAMC_0/result_PORTA]
connect_bd_intf_net [get_bd_intf_pins axi_dma_0/M_AXI_MM2S] [get_bd_intf_pins M_AXI_MM2S]
connect_bd_intf_net [get_bd_intf_pins axi_dma_0/M_AXI_S2MM] [get_bd_intf_pins M_AXI_S2MM]
connect_bd_intf_net [get_bd_intf_pins axi_bram_ctrl_0/S_AXI] [get_bd_intf_pins S_AXI]
connect_bd_intf_net [get_bd_intf_pins axi_dma_0/S_AXI_LITE] [get_bd_intf_pins S_AXI_LITE]
connect_bd_intf_net [get_bd_intf_pins axi_dma_1/M_AXI_MM2S] [get_bd_intf_pins M_AXI_MM2S1]
connect_bd_intf_net [get_bd_intf_pins axi_dma_1/M_AXI_S2MM] [get_bd_intf_pins M_AXI_S2MM1]
connect_bd_intf_net [get_bd_intf_pins axi_dma_1/S_AXI_LITE] [get_bd_intf_pins S_AXI_LITE1]
connect_bd_intf_net [get_bd_intf_pins CAMC_0/s_axi_CTRL] [get_bd_intf_pins s_axi_CTRL]
connect_bd_intf_net [get_bd_intf_pins axi_bram_ctrl_0/BRAM_PORTA] [get_bd_intf_pins blk_mem_gen_0/BRAM_PORTA]
connect_bd_intf_net [get_bd_intf_pins CAMC_0/input_X] [get_bd_intf_pins axi_dma_0/M_AXIS_MM2S]
connect_bd_intf_net [get_bd_intf_pins CAMC_0/input_Y] [get_bd_intf_pins axi_dma_1/M_AXIS_MM2S]
connect_bd_net [get_bd_pins peripheral_aresetn] \
  [get_bd_pins axi_bram_ctrl_0/s_axi_aresetn] [get_bd_pins CAMC_0/ap_rst_n] [get_bd_pins axi_dma_0/axi_resetn] \
  [get_bd_pins axi_dma_1/axi_resetn]
connect_bd_net -net pl_clk0_1 [get_bd_pins pl_clk0] \
  [get_bd_pins axi_bram_ctrl_0/s_axi_aclk] [get_bd_pins axi_dma_0/m_axi_mm2s_aclk] [get_bd_pins CAMC_0/ap_clk] \
  [get_bd_pins axi_dma_0/m_axi_s2mm_aclk] [get_bd_pins axi_dma_0/s_axi_lite_aclk] [get_bd_pins axi_dma_1/m_axi_mm2s_aclk] \
  [get_bd_pins axi_dma_1/m_axi_s2mm_aclk] [get_bd_pins axi_dma_1/s_axi_lite_aclk]

current_bd_instance /hp_sec1/One_port8/CAMC_with2
connect_bd_intf_net [get_bd_intf_pins axi_dma_0/S_AXIS_S2MM] [get_bd_intf_pins CAMC_0/outStream_1]
connect_bd_intf_net [get_bd_intf_pins axi_dma_1/S_AXIS_S2MM] [get_bd_intf_pins CAMC_0/outStream_2]
connect_bd_intf_net [get_bd_intf_pins blk_mem_gen_0/BRAM_PORTB] [get_bd_intf_pins CAMC_0/result_PORTA]
connect_bd_intf_net [get_bd_intf_pins axi_dma_0/M_AXI_MM2S] [get_bd_intf_pins M_AXI_MM2S]
connect_bd_intf_net [get_bd_intf_pins axi_dma_0/M_AXI_S2MM] [get_bd_intf_pins M_AXI_S2MM]
connect_bd_intf_net [get_bd_intf_pins axi_bram_ctrl_0/S_AXI] [get_bd_intf_pins S_AXI]
connect_bd_intf_net [get_bd_intf_pins axi_dma_0/S_AXI_LITE] [get_bd_intf_pins S_AXI_LITE]
connect_bd_intf_net [get_bd_intf_pins axi_dma_1/M_AXI_MM2S] [get_bd_intf_pins M_AXI_MM2S1]
connect_bd_intf_net [get_bd_intf_pins axi_dma_1/M_AXI_S2MM] [get_bd_intf_pins M_AXI_S2MM1]
connect_bd_intf_net [get_bd_intf_pins axi_dma_1/S_AXI_LITE] [get_bd_intf_pins S_AXI_LITE1]
connect_bd_intf_net [get_bd_intf_pins CAMC_0/s_axi_CTRL] [get_bd_intf_pins s_axi_CTRL]
connect_bd_intf_net [get_bd_intf_pins axi_bram_ctrl_0/BRAM_PORTA] [get_bd_intf_pins blk_mem_gen_0/BRAM_PORTA]
connect_bd_intf_net [get_bd_intf_pins CAMC_0/input_X] [get_bd_intf_pins axi_dma_0/M_AXIS_MM2S]
connect_bd_intf_net [get_bd_intf_pins CAMC_0/input_Y] [get_bd_intf_pins axi_dma_1/M_AXIS_MM2S]
connect_bd_net [get_bd_pins peripheral_aresetn] \
  [get_bd_pins axi_bram_ctrl_0/s_axi_aresetn] [get_bd_pins CAMC_0/ap_rst_n] [get_bd_pins axi_dma_0/axi_resetn] \
  [get_bd_pins axi_dma_1/axi_resetn]
connect_bd_net -net pl_clk0_1 [get_bd_pins pl_clk0] \
  [get_bd_pins axi_bram_ctrl_0/s_axi_aclk] [get_bd_pins axi_dma_0/m_axi_mm2s_aclk] [get_bd_pins CAMC_0/ap_clk] \
  [get_bd_pins axi_dma_0/m_axi_s2mm_aclk] [get_bd_pins axi_dma_0/s_axi_lite_aclk] [get_bd_pins axi_dma_1/m_axi_mm2s_aclk] \
  [get_bd_pins axi_dma_1/m_axi_s2mm_aclk] [get_bd_pins axi_dma_1/s_axi_lite_aclk]

current_bd_instance /hp_sec1/One_port8/CAMC_with3
connect_bd_intf_net [get_bd_intf_pins axi_dma_0/S_AXIS_S2MM] [get_bd_intf_pins CAMC_0/outStream_1]
connect_bd_intf_net [get_bd_intf_pins axi_dma_1/S_AXIS_S2MM] [get_bd_intf_pins CAMC_0/outStream_2]
connect_bd_intf_net [get_bd_intf_pins blk_mem_gen_0/BRAM_PORTB] [get_bd_intf_pins CAMC_0/result_PORTA]
connect_bd_intf_net [get_bd_intf_pins axi_dma_0/M_AXI_MM2S] [get_bd_intf_pins M_AXI_MM2S]
connect_bd_intf_net [get_bd_intf_pins axi_dma_0/M_AXI_S2MM] [get_bd_intf_pins M_AXI_S2MM]
connect_bd_intf_net [get_bd_intf_pins axi_bram_ctrl_0/S_AXI] [get_bd_intf_pins S_AXI]
connect_bd_intf_net [get_bd_intf_pins axi_dma_0/S_AXI_LITE] [get_bd_intf_pins S_AXI_LITE]
connect_bd_intf_net [get_bd_intf_pins axi_dma_1/M_AXI_MM2S] [get_bd_intf_pins M_AXI_MM2S1]
connect_bd_intf_net [get_bd_intf_pins axi_dma_1/M_AXI_S2MM] [get_bd_intf_pins M_AXI_S2MM1]
connect_bd_intf_net [get_bd_intf_pins axi_dma_1/S_AXI_LITE] [get_bd_intf_pins S_AXI_LITE1]
connect_bd_intf_net [get_bd_intf_pins CAMC_0/s_axi_CTRL] [get_bd_intf_pins s_axi_CTRL]
connect_bd_intf_net [get_bd_intf_pins axi_bram_ctrl_0/BRAM_PORTA] [get_bd_intf_pins blk_mem_gen_0/BRAM_PORTA]
connect_bd_intf_net [get_bd_intf_pins CAMC_0/input_X] [get_bd_intf_pins axi_dma_0/M_AXIS_MM2S]
connect_bd_intf_net [get_bd_intf_pins CAMC_0/input_Y] [get_bd_intf_pins axi_dma_1/M_AXIS_MM2S]
connect_bd_net [get_bd_pins peripheral_aresetn] \
  [get_bd_pins axi_bram_ctrl_0/s_axi_aresetn] [get_bd_pins CAMC_0/ap_rst_n] [get_bd_pins axi_dma_0/axi_resetn] \
  [get_bd_pins axi_dma_1/axi_resetn]
connect_bd_net -net pl_clk0_1 [get_bd_pins pl_clk0] \
  [get_bd_pins axi_bram_ctrl_0/s_axi_aclk] [get_bd_pins axi_dma_0/m_axi_mm2s_aclk] [get_bd_pins CAMC_0/ap_clk] \
  [get_bd_pins axi_dma_0/m_axi_s2mm_aclk] [get_bd_pins axi_dma_0/s_axi_lite_aclk] [get_bd_pins axi_dma_1/m_axi_mm2s_aclk] \
  [get_bd_pins axi_dma_1/m_axi_s2mm_aclk] [get_bd_pins axi_dma_1/s_axi_lite_aclk]

current_bd_instance /hp_sec2
connect_bd_intf_net [get_bd_intf_pins smartconnect_0/S00_AXI] [get_bd_intf_pins S00_AXI]
connect_bd_intf_net [get_bd_intf_pins M00_AXI] [get_bd_intf_pins One_port8/M00_AXI]
connect_bd_intf_net [get_bd_intf_pins One_port8/S_AXI1] [get_bd_intf_pins smartconnect_0/M01_AXI]
connect_bd_intf_net [get_bd_intf_pins One_port8/S_AXI2] [get_bd_intf_pins smartconnect_0/M02_AXI]
connect_bd_intf_net [get_bd_intf_pins One_port8/S_AXI3] [get_bd_intf_pins smartconnect_0/M03_AXI]
connect_bd_intf_net [get_bd_intf_pins One_port8/S_AXI] [get_bd_intf_pins smartconnect_0/M00_AXI]
connect_bd_intf_net [get_bd_intf_pins One_port8/S_AXI_LITE1] [get_bd_intf_pins smartconnect_0/M05_AXI]
connect_bd_intf_net [get_bd_intf_pins One_port8/S_AXI_LITE2] [get_bd_intf_pins smartconnect_0/M06_AXI]
connect_bd_intf_net [get_bd_intf_pins One_port8/S_AXI_LITE] [get_bd_intf_pins smartconnect_0/M04_AXI]
connect_bd_intf_net [get_bd_intf_pins smartconnect_0/M07_AXI] [get_bd_intf_pins One_port8/S_AXI_LITE3]
connect_bd_intf_net [get_bd_intf_pins smartconnect_0/M08_AXI] [get_bd_intf_pins One_port8/S_AXI_LITE4]
connect_bd_intf_net [get_bd_intf_pins smartconnect_0/M09_AXI] [get_bd_intf_pins One_port8/S_AXI_LITE5]
connect_bd_intf_net [get_bd_intf_pins smartconnect_0/M10_AXI] [get_bd_intf_pins One_port8/S_AXI_LITE6]
connect_bd_intf_net [get_bd_intf_pins smartconnect_0/M11_AXI] [get_bd_intf_pins One_port8/S_AXI_LITE7]
connect_bd_intf_net [get_bd_intf_pins smartconnect_0/M12_AXI] [get_bd_intf_pins One_port8/s_axi_CTRL]
connect_bd_intf_net [get_bd_intf_pins smartconnect_0/M13_AXI] [get_bd_intf_pins One_port8/s_axi_CTRL1]
connect_bd_intf_net [get_bd_intf_pins smartconnect_0/M14_AXI] [get_bd_intf_pins One_port8/s_axi_CTRL2]
connect_bd_intf_net [get_bd_intf_pins smartconnect_0/M15_AXI] [get_bd_intf_pins One_port8/s_axi_CTRL3]
connect_bd_net [get_bd_pins s_axi_aclk] [get_bd_pins One_port8/s_axi_aclk] [get_bd_pins smartconnect_0/aclk]
connect_bd_net [get_bd_pins s_axi_aresetn] [get_bd_pins One_port8/s_axi_aresetn]

current_bd_instance /hp_sec2/One_port8
connect_bd_intf_net [get_bd_intf_pins axi_interconnect_0/M00_AXI] [get_bd_intf_pins M00_AXI]
connect_bd_intf_net [get_bd_intf_pins CAMC_with/S_AXI] [get_bd_intf_pins S_AXI]
connect_bd_intf_net [get_bd_intf_pins CAMC_with1/S_AXI] [get_bd_intf_pins S_AXI1]
connect_bd_intf_net [get_bd_intf_pins CAMC_with2/S_AXI] [get_bd_intf_pins S_AXI2]
connect_bd_intf_net [get_bd_intf_pins CAMC_with3/S_AXI] [get_bd_intf_pins S_AXI3]
connect_bd_intf_net [get_bd_intf_pins CAMC_with/S_AXI_LITE] [get_bd_intf_pins S_AXI_LITE]
connect_bd_intf_net [get_bd_intf_pins CAMC_with/S_AXI_LITE1] [get_bd_intf_pins S_AXI_LITE1]
connect_bd_intf_net [get_bd_intf_pins CAMC_with1/S_AXI_LITE] [get_bd_intf_pins S_AXI_LITE2]
connect_bd_intf_net [get_bd_intf_pins CAMC_with1/S_AXI_LITE1] [get_bd_intf_pins S_AXI_LITE3]
connect_bd_intf_net [get_bd_intf_pins CAMC_with2/S_AXI_LITE] [get_bd_intf_pins S_AXI_LITE4]
connect_bd_intf_net [get_bd_intf_pins CAMC_with2/S_AXI_LITE1] [get_bd_intf_pins S_AXI_LITE5]
connect_bd_intf_net [get_bd_intf_pins CAMC_with3/S_AXI_LITE] [get_bd_intf_pins S_AXI_LITE6]
connect_bd_intf_net [get_bd_intf_pins CAMC_with3/S_AXI_LITE1] [get_bd_intf_pins S_AXI_LITE7]
connect_bd_intf_net [get_bd_intf_pins CAMC_with/s_axi_CTRL] [get_bd_intf_pins s_axi_CTRL]
connect_bd_intf_net [get_bd_intf_pins CAMC_with1/s_axi_CTRL] [get_bd_intf_pins s_axi_CTRL1]
connect_bd_intf_net [get_bd_intf_pins CAMC_with2/s_axi_CTRL] [get_bd_intf_pins s_axi_CTRL2]
connect_bd_intf_net [get_bd_intf_pins CAMC_with3/s_axi_CTRL] [get_bd_intf_pins s_axi_CTRL3]
connect_bd_intf_net [get_bd_intf_pins axi_interconnect_0/S00_AXI] [get_bd_intf_pins CAMC_with/M_AXI_MM2S]
connect_bd_intf_net [get_bd_intf_pins axi_interconnect_0/S01_AXI] [get_bd_intf_pins CAMC_with/M_AXI_S2MM]
connect_bd_intf_net [get_bd_intf_pins axi_interconnect_0/S02_AXI] [get_bd_intf_pins CAMC_with1/M_AXI_MM2S]
connect_bd_intf_net [get_bd_intf_pins axi_interconnect_0/S03_AXI] [get_bd_intf_pins CAMC_with1/M_AXI_S2MM]
connect_bd_intf_net [get_bd_intf_pins axi_interconnect_0/S04_AXI] [get_bd_intf_pins CAMC_with2/M_AXI_MM2S]
connect_bd_intf_net [get_bd_intf_pins axi_interconnect_0/S05_AXI] [get_bd_intf_pins CAMC_with2/M_AXI_S2MM]
connect_bd_intf_net [get_bd_intf_pins axi_interconnect_0/S06_AXI] [get_bd_intf_pins CAMC_with3/M_AXI_MM2S]
connect_bd_intf_net [get_bd_intf_pins axi_interconnect_0/S07_AXI] [get_bd_intf_pins CAMC_with3/M_AXI_S2MM]
connect_bd_intf_net [get_bd_intf_pins axi_interconnect_0/S08_AXI] [get_bd_intf_pins CAMC_with/M_AXI_MM2S1]
connect_bd_intf_net [get_bd_intf_pins axi_interconnect_0/S09_AXI] [get_bd_intf_pins CAMC_with/M_AXI_S2MM1]
connect_bd_intf_net [get_bd_intf_pins axi_interconnect_0/S10_AXI] [get_bd_intf_pins CAMC_with1/M_AXI_MM2S1]
connect_bd_intf_net [get_bd_intf_pins axi_interconnect_0/S11_AXI] [get_bd_intf_pins CAMC_with1/M_AXI_S2MM1]
connect_bd_intf_net [get_bd_intf_pins axi_interconnect_0/S12_AXI] [get_bd_intf_pins CAMC_with2/M_AXI_MM2S1]
connect_bd_intf_net [get_bd_intf_pins axi_interconnect_0/S13_AXI] [get_bd_intf_pins CAMC_with2/M_AXI_S2MM1]
connect_bd_intf_net [get_bd_intf_pins axi_interconnect_0/S14_AXI] [get_bd_intf_pins CAMC_with3/M_AXI_MM2S1]
connect_bd_intf_net [get_bd_intf_pins axi_interconnect_0/S15_AXI] [get_bd_intf_pins CAMC_with3/M_AXI_S2MM1]
connect_bd_net [get_bd_pins s_axi_aclk] \
  [get_bd_pins CAMC_with/s_axi_aclk] [get_bd_pins CAMC_with1/pl_clk0] [get_bd_pins CAMC_with2/pl_clk0] \
  [get_bd_pins CAMC_with3/pl_clk0] [get_bd_pins axi_interconnect_0/S00_ACLK] [get_bd_pins axi_interconnect_0/S01_ACLK] \
  [get_bd_pins axi_interconnect_0/S08_ACLK] [get_bd_pins axi_interconnect_0/M00_ACLK] [get_bd_pins axi_interconnect_0/ACLK] \
  [get_bd_pins axi_interconnect_0/S09_ACLK] [get_bd_pins axi_interconnect_0/S02_ACLK] \
  [get_bd_pins axi_interconnect_0/S03_ACLK] [get_bd_pins axi_interconnect_0/S10_ACLK] \
  [get_bd_pins axi_interconnect_0/S11_ACLK] [get_bd_pins axi_interconnect_0/S04_ACLK] \
  [get_bd_pins axi_interconnect_0/S05_ACLK] [get_bd_pins axi_interconnect_0/S12_ACLK] \
  [get_bd_pins axi_interconnect_0/S13_ACLK] [get_bd_pins axi_interconnect_0/S06_ACLK] \
  [get_bd_pins axi_interconnect_0/S07_ACLK] [get_bd_pins axi_interconnect_0/S14_ACLK] \
  [get_bd_pins axi_interconnect_0/S15_ACLK]
connect_bd_net [get_bd_pins s_axi_aresetn] \
  [get_bd_pins CAMC_with/s_axi_aresetn] [get_bd_pins CAMC_with1/peripheral_aresetn] \
  [get_bd_pins CAMC_with2/peripheral_aresetn] [get_bd_pins CAMC_with3/peripheral_aresetn] \
  [get_bd_pins axi_interconnect_0/S00_ARESETN] [get_bd_pins axi_interconnect_0/S01_ARESETN] \
  [get_bd_pins axi_interconnect_0/S08_ARESETN] [get_bd_pins axi_interconnect_0/M00_ARESETN] \
  [get_bd_pins axi_interconnect_0/ARESETN] [get_bd_pins axi_interconnect_0/S09_ARESETN] \
  [get_bd_pins axi_interconnect_0/S02_ARESETN] [get_bd_pins axi_interconnect_0/S03_ARESETN] \
  [get_bd_pins axi_interconnect_0/S10_ARESETN] [get_bd_pins axi_interconnect_0/S11_ARESETN] \
  [get_bd_pins axi_interconnect_0/S04_ARESETN] [get_bd_pins axi_interconnect_0/S05_ARESETN] \
  [get_bd_pins axi_interconnect_0/S12_ARESETN] [get_bd_pins axi_interconnect_0/S13_ARESETN] \
  [get_bd_pins axi_interconnect_0/S06_ARESETN] [get_bd_pins axi_interconnect_0/S07_ARESETN] \
  [get_bd_pins axi_interconnect_0/S14_ARESETN] [get_bd_pins axi_interconnect_0/S15_ARESETN]

current_bd_instance /hp_sec2/One_port8/CAMC_with
connect_bd_intf_net [get_bd_intf_pins axi_dma_0/S_AXIS_S2MM] [get_bd_intf_pins CAMC_0/outStream_1]
connect_bd_intf_net [get_bd_intf_pins axi_dma_1/S_AXIS_S2MM] [get_bd_intf_pins CAMC_0/outStream_2]
connect_bd_intf_net [get_bd_intf_pins blk_mem_gen_0/BRAM_PORTB] [get_bd_intf_pins CAMC_0/result_PORTA]
connect_bd_intf_net [get_bd_intf_pins axi_dma_0/M_AXI_MM2S] [get_bd_intf_pins M_AXI_MM2S]
connect_bd_intf_net [get_bd_intf_pins axi_dma_0/M_AXI_S2MM] [get_bd_intf_pins M_AXI_S2MM]
connect_bd_intf_net [get_bd_intf_pins axi_bram_ctrl_0/S_AXI] [get_bd_intf_pins S_AXI]
connect_bd_intf_net [get_bd_intf_pins axi_dma_0/S_AXI_LITE] [get_bd_intf_pins S_AXI_LITE]
connect_bd_intf_net [get_bd_intf_pins axi_dma_1/M_AXI_MM2S] [get_bd_intf_pins M_AXI_MM2S1]
connect_bd_intf_net [get_bd_intf_pins axi_dma_1/M_AXI_S2MM] [get_bd_intf_pins M_AXI_S2MM1]
connect_bd_intf_net [get_bd_intf_pins axi_dma_1/S_AXI_LITE] [get_bd_intf_pins S_AXI_LITE1]
connect_bd_intf_net [get_bd_intf_pins CAMC_0/s_axi_CTRL] [get_bd_intf_pins s_axi_CTRL]
connect_bd_intf_net [get_bd_intf_pins axi_bram_ctrl_0/BRAM_PORTA] [get_bd_intf_pins blk_mem_gen_0/BRAM_PORTA]
connect_bd_intf_net [get_bd_intf_pins CAMC_0/input_X] [get_bd_intf_pins axi_dma_0/M_AXIS_MM2S]
connect_bd_intf_net [get_bd_intf_pins CAMC_0/input_Y] [get_bd_intf_pins axi_dma_1/M_AXIS_MM2S]
connect_bd_net [get_bd_pins s_axi_aclk] \
  [get_bd_pins axi_bram_ctrl_0/s_axi_aclk] [get_bd_pins axi_dma_0/m_axi_mm2s_aclk] [get_bd_pins CAMC_0/ap_clk] \
  [get_bd_pins axi_dma_0/m_axi_s2mm_aclk] [get_bd_pins axi_dma_0/s_axi_lite_aclk] [get_bd_pins axi_dma_1/m_axi_mm2s_aclk] \
  [get_bd_pins axi_dma_1/m_axi_s2mm_aclk] [get_bd_pins axi_dma_1/s_axi_lite_aclk]
connect_bd_net [get_bd_pins s_axi_aresetn] \
  [get_bd_pins axi_bram_ctrl_0/s_axi_aresetn] [get_bd_pins CAMC_0/ap_rst_n] [get_bd_pins axi_dma_0/axi_resetn] \
  [get_bd_pins axi_dma_1/axi_resetn]

current_bd_instance /hp_sec2/One_port8/CAMC_with1
connect_bd_intf_net [get_bd_intf_pins axi_dma_0/S_AXIS_S2MM] [get_bd_intf_pins CAMC_0/outStream_1]
connect_bd_intf_net [get_bd_intf_pins axi_dma_1/S_AXIS_S2MM] [get_bd_intf_pins CAMC_0/outStream_2]
connect_bd_intf_net [get_bd_intf_pins blk_mem_gen_0/BRAM_PORTB] [get_bd_intf_pins CAMC_0/result_PORTA]
connect_bd_intf_net [get_bd_intf_pins axi_dma_0/M_AXI_MM2S] [get_bd_intf_pins M_AXI_MM2S]
connect_bd_intf_net [get_bd_intf_pins axi_dma_0/M_AXI_S2MM] [get_bd_intf_pins M_AXI_S2MM]
connect_bd_intf_net [get_bd_intf_pins axi_bram_ctrl_0/S_AXI] [get_bd_intf_pins S_AXI]
connect_bd_intf_net [get_bd_intf_pins axi_dma_0/S_AXI_LITE] [get_bd_intf_pins S_AXI_LITE]
connect_bd_intf_net [get_bd_intf_pins axi_dma_1/M_AXI_MM2S] [get_bd_intf_pins M_AXI_MM2S1]
connect_bd_intf_net [get_bd_intf_pins axi_dma_1/M_AXI_S2MM] [get_bd_intf_pins M_AXI_S2MM1]
connect_bd_intf_net [get_bd_intf_pins axi_dma_1/S_AXI_LITE] [get_bd_intf_pins S_AXI_LITE1]
connect_bd_intf_net [get_bd_intf_pins CAMC_0/s_axi_CTRL] [get_bd_intf_pins s_axi_CTRL]
connect_bd_intf_net [get_bd_intf_pins axi_bram_ctrl_0/BRAM_PORTA] [get_bd_intf_pins blk_mem_gen_0/BRAM_PORTA]
connect_bd_intf_net [get_bd_intf_pins CAMC_0/input_X] [get_bd_intf_pins axi_dma_0/M_AXIS_MM2S]
connect_bd_intf_net [get_bd_intf_pins CAMC_0/input_Y] [get_bd_intf_pins axi_dma_1/M_AXIS_MM2S]
connect_bd_net [get_bd_pins peripheral_aresetn] \
  [get_bd_pins axi_bram_ctrl_0/s_axi_aresetn] [get_bd_pins CAMC_0/ap_rst_n] [get_bd_pins axi_dma_0/axi_resetn] \
  [get_bd_pins axi_dma_1/axi_resetn]
connect_bd_net -net pl_clk0_1 [get_bd_pins pl_clk0] \
  [get_bd_pins axi_bram_ctrl_0/s_axi_aclk] [get_bd_pins axi_dma_0/m_axi_mm2s_aclk] [get_bd_pins CAMC_0/ap_clk] \
  [get_bd_pins axi_dma_0/m_axi_s2mm_aclk] [get_bd_pins axi_dma_0/s_axi_lite_aclk] [get_bd_pins axi_dma_1/m_axi_mm2s_aclk] \
  [get_bd_pins axi_dma_1/m_axi_s2mm_aclk] [get_bd_pins axi_dma_1/s_axi_lite_aclk]
